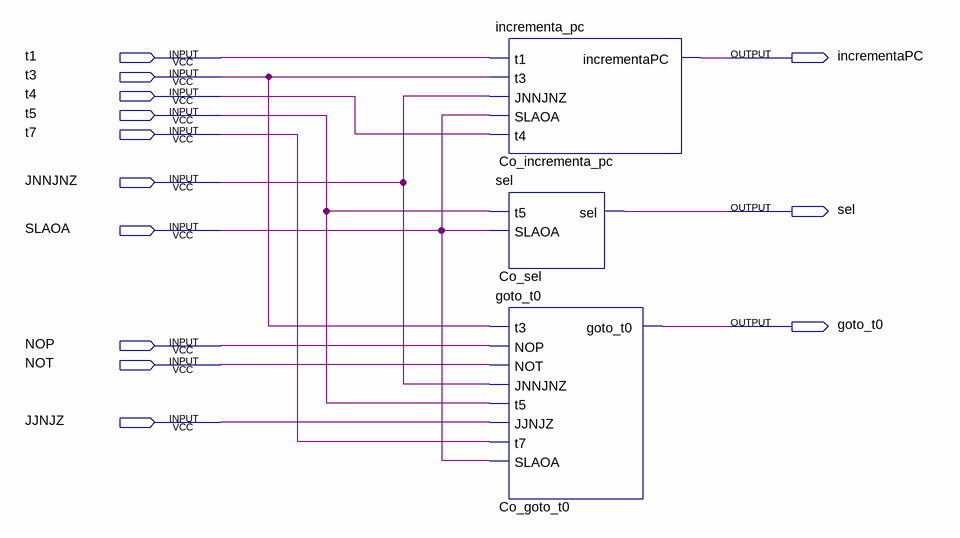
[diagram p0: schematic sheet]
// Quartus schematic control.bdf as structural Verilog: 3 symbols, 13 pins
module control (
  input  t1,
  input  t3,
  input  t4,
  input  t5,
  input  t7,
  input  JNNJNZ,
  input  SLAOA,
  input  NOP,
  input  NOT,
  input  JJNJZ,
  output incrementaPC,
  output sel,
  output goto_t0
);

  incrementa_pc Co_incrementa_pc (
    .t1(t1), .t3(t3), .JNNJNZ(JNNJNZ), .SLAOA(SLAOA), .t4(t4), .incrementaPC(incrementaPC));
  sel Co_sel (.t5(t5), .SLAOA(SLAOA), .sel(sel));
  goto_t0 Co_goto_t0 (
    .t3(t3), .NOP(NOP), .NOT(NOT), .JNNJNZ(JNNJNZ), .t5(t5), .JJNJZ(JJNJZ), .t7(t7), .SLAOA(SLAOA),
    .goto_t0(goto_t0));
endmodule
